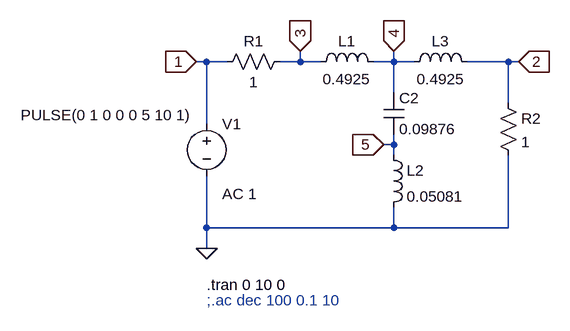
[diagram p0: schematic Transient-circuit.asc]
Transient-circuit.asc, the LTspice schematic file:
Version 4
SHEET 1 880 680
WIRE 144 80 128 80
WIRE 176 80 144 80
WIRE 288 80 288 64
WIRE 288 80 256 80
WIRE 320 80 288 80
WIRE 432 80 432 64
WIRE 432 80 400 80
WIRE 464 80 432 80
WIRE 608 80 544 80
WIRE 624 80 608 80
WIRE 432 128 432 80
WIRE 608 144 608 80
WIRE 144 176 144 80
WIRE 432 208 432 192
WIRE 432 208 416 208
WIRE 432 224 432 208
WIRE 144 336 144 256
WIRE 432 336 432 304
WIRE 432 336 144 336
WIRE 608 336 608 224
WIRE 608 336 432 336
WIRE 144 368 144 336
FLAG 144 368 0
FLAG 128 80 1
IOPIN 128 80 In
FLAG 288 64 3
IOPIN 288 64 In
FLAG 624 80 2
IOPIN 624 80 In
FLAG 416 208 5
IOPIN 416 208 In
FLAG 432 64 4
IOPIN 432 64 In
SYMBOL voltage 144 160 R0
WINDOW 3 -286 2 Left 2
WINDOW 123 24 124 Left 2
WINDOW 39 0 0 Left 0
SYMATTR Value PULSE(0 1 0 0 0 5 10 1)
SYMATTR Value2 AC 1
SYMATTR InstName V1
SYMBOL res 272 64 R90
WINDOW 0 0 56 VBottom 2
WINDOW 3 32 56 VTop 2
SYMATTR InstName R1
SYMATTR Value 1
SYMBOL res 592 128 R0
SYMATTR InstName R2
SYMATTR Value 1
SYMBOL ind 304 96 R270
WINDOW 0 32 56 VTop 2
WINDOW 3 5 56 VBottom 2
SYMATTR InstName L1
SYMATTR Value 0.4925
SYMBOL ind 416 208 R0
SYMATTR InstName L2
SYMATTR Value 0.05081
SYMBOL cap 416 128 R0
SYMATTR InstName C2
SYMATTR Value 0.09876
SYMBOL ind 448 96 R270
WINDOW 0 32 56 VTop 2
WINDOW 3 5 56 VBottom 2
SYMATTR InstName L3
SYMATTR Value 0.4925
TEXT 144 448 Left 2 ;;.ac dec 100 0.1 10
TEXT 144 424 Left 2 !.tran 0 10 0

The netlist it stands for:
* Transient-circuit.asc
V1 1 0 PULSE(0 1 0 0 0 5 10 1) AC 1
R1 3 1 1
R2 2 0 1
L1 3 4 0.4925
L2 5 0 0.05081
C2 4 5 0.09876
L3 4 2 0.4925
* ;.ac dec 100 0.1 10
.tran 0 10 0
.backanno
.end